# Altium project ina_board_1.PrjPcb
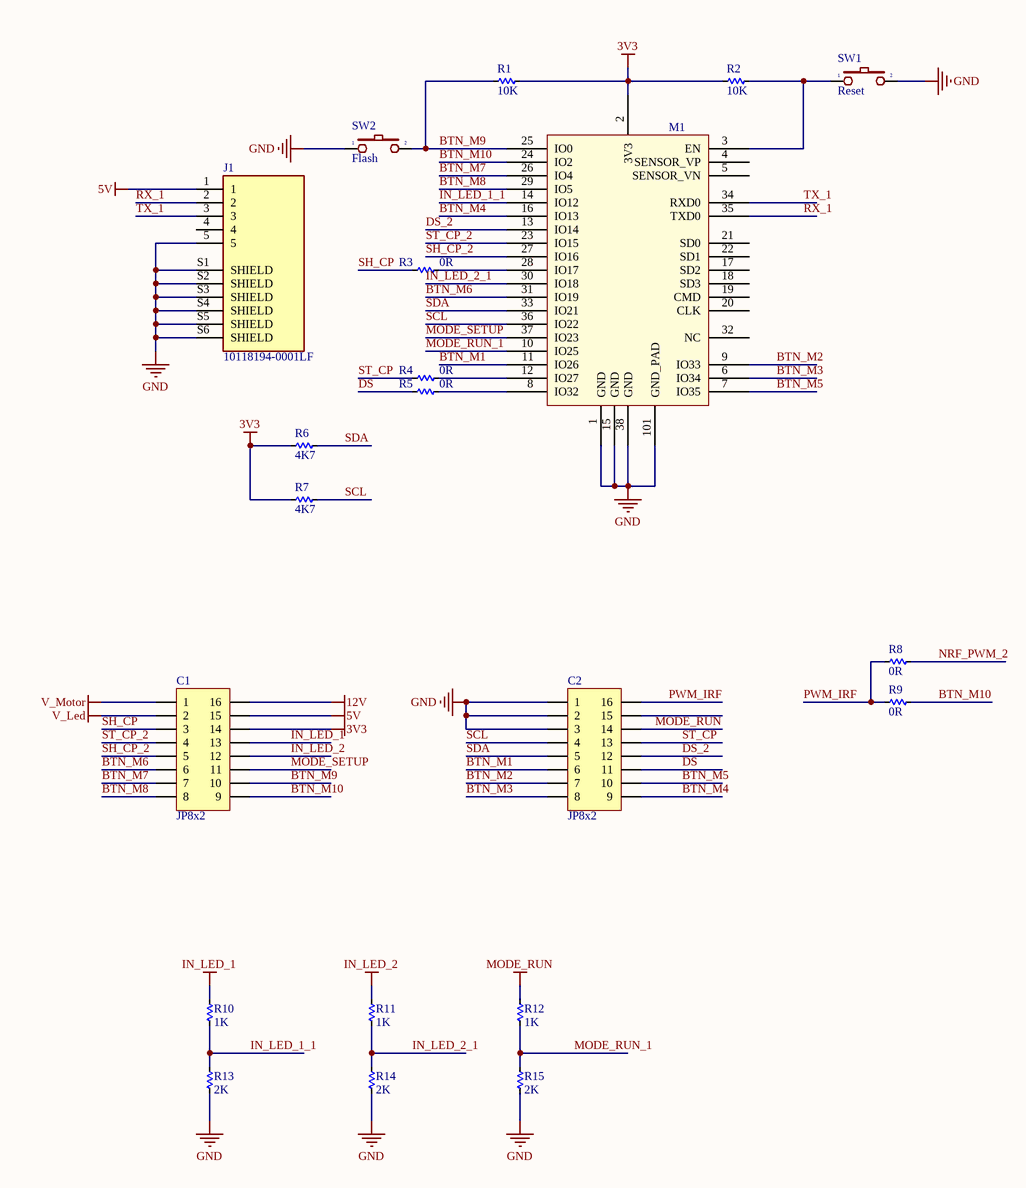
[diagram p0: esp32.SchDoc]
3 sheets, 106 parts. Net scope: global (net labels, ports and power ports of the same name join across sheets).
Board file: board_1.PcbDoc
Sheets:
  esp32.SchDoc
  nrf51.SchDoc
  power.SchDoc

## Sheet esp32.SchDoc
size A3

### Parts
C1  JP8x2  [JP8-C2T]
C2  JP8x2  [JP8-C2T]
J1  10118194-0001LF  [AMPHENOL_10118194-0001LF]
M1  ESP32S_Module  [ESP32S]  (value not drawn)
R1  10K  [RES-SMD-0603]
R2  10K  [RES-SMD-0603]
R3  0R  [RES-SMD-0603]
R4  0R  [RES-SMD-0603]
R5  0R  [RES-SMD-0603]
R6  4K7  [RES-SMD-0603]
R7  4K7  [RES-SMD-0603]
R8  0R  [RES-SMD-0603]
R9  0R  [RES-SMD-0603]
R10  1K  [RES-SMD-0603]
R11  1K  [RES-SMD-0603]
R12  1K  [RES-SMD-0603]
R13  2K  [RES-SMD-0603]
R14  2K  [RES-SMD-0603]
R15  2K  [RES-SMD-0603]
SW1  Reset  [SW1-SMD]
SW2  Flash  [SW-DIP1-1]

### Nets
3V3: C1.14 M1.2(3V3) R1.1 R2.2 R6.1 R7.1
5V: C1.15 J1.1
12V: C1.16
GND: C2.1 C2.2 C2.3 J1.5 J1.S1(SHIELD) J1.S2(SHIELD) J1.S3(SHIELD) J1.S4(SHIELD) J1.S5(SHIELD) J1.S6(SHIELD) M1.1(GND) M1.15(GND) M1.38(GND) M1.101(GND_PAD) R13.1 R14.1 R15.1 SW1.2 SW2.1
IN_LED_1: C1.13 R10.2
IN_LED_2: C1.12 R11.2
MODE_RUN: C2.14 R12.2
V_Led: C1.2
V_Motor: C1.1
BTN_M1: C2.6 M1.11(IO26)
BTN_M2: C2.7 M1.9(IO33)
BTN_M3: C2.8 M1.6(IO34)
BTN_M4: C2.9 M1.16(IO13)
BTN_M5: C2.10 M1.7(IO35)
BTN_M6: C1.6 M1.31(IO19)
BTN_M7: C1.7 M1.26(IO4)
BTN_M8: C1.8 M1.29(IO5)
BTN_M9: C1.10 M1.25(IO0) R1.2 SW2.2
BTN_M10: C1.9 M1.24(IO2) R9.1
DS: C2.11 R5.1
DS_2: C2.12 M1.13(IO14)
IN_LED_1_1: M1.14(IO12) R10.1 R13.2
IN_LED_2_1: M1.30(IO18) R11.1 R14.2
MODE_RUN_1: M1.10(IO25) R12.1 R15.2
MODE_SETUP: C1.11 M1.37(IO23)
NRF_PWM_2: R8.1
PWM_IRF: C2.16 R8.2 R9.2
RX_1: J1.2 M1.35(TXD0)
SCL: C2.4 M1.36(IO22) R7.2
SDA: C2.5 M1.33(IO21) R6.2
SH_CP: C1.3 R3.1
SH_CP_2: C1.5 M1.27(IO16)
ST_CP: C2.13 R4.1
ST_CP_2: C1.4 M1.23(IO15)
TX_1: J1.3 M1.34(RXD0)
NetM1_3: M1.3(EN) R2.1 SW1.1
NetM1_8: M1.8(IO32) R5.2
NetM1_12: M1.12(IO27) R4.2
NetM1_28: M1.28(IO17) R3.2

Not connected (* = marked no-connect by the designer): C2 15; J1 4; M1 4(SENSOR_VP) 5(SENSOR_VN) 17(SD2) 18(SD3) 19(CMD) 20(CLK) 21(SD0) 22(SD1) 32(NC)

### Library data of the parts
C1 C2 = JP8x2: WR-PHD 2.54 mm Dual Socket Header; Manufacturer: W¨¹rth Elektronik eiSos GmbH; partNo: 61301621821; ComponentLink1 Description: Manufacturer; ComponentLink2 Description: Datasheet; NoPins: 16; Created Date: 29 March 2013; ComponentLink1URL: http://www.we-online.com; ComponentLink2URL: http://katalog.we-online.de/em/datasheet/6130xx21821.pdf; Created by: Karrer Zheng
J1 = 10118194-0001LF: USB - micro B USB 2.0 Receptacle Connector 5 Position Surface Mount, Right Angle; Through Hole; MF: Amphenol ICC; Package: None; Price: None; Availability: Unavailable; MP: 10118194-0001LF; SnapEDA_Link: https://www.snapeda.com/parts/10118194-0001LF/Amphenol%20FCI/view-part/1413308/?ref=snap; Value: *
M1 = ESP32S_Module: Esp-32S; Datasheet: https://espressif.com/sites/default/files/documentation/esp_wroom_32_datasheet_en.pdf
R1-R15 = Res-SMD: Resistor; Manufacturer: Generic Components; Class: Passive; Published: 08/06/2000; Publisher: Altium Hobart Technology Centre
SW1 SW2 = SW2: Switch button 2 pin; Value: SW chip 2 pin

## Sheet nrf51.SchDoc
size A
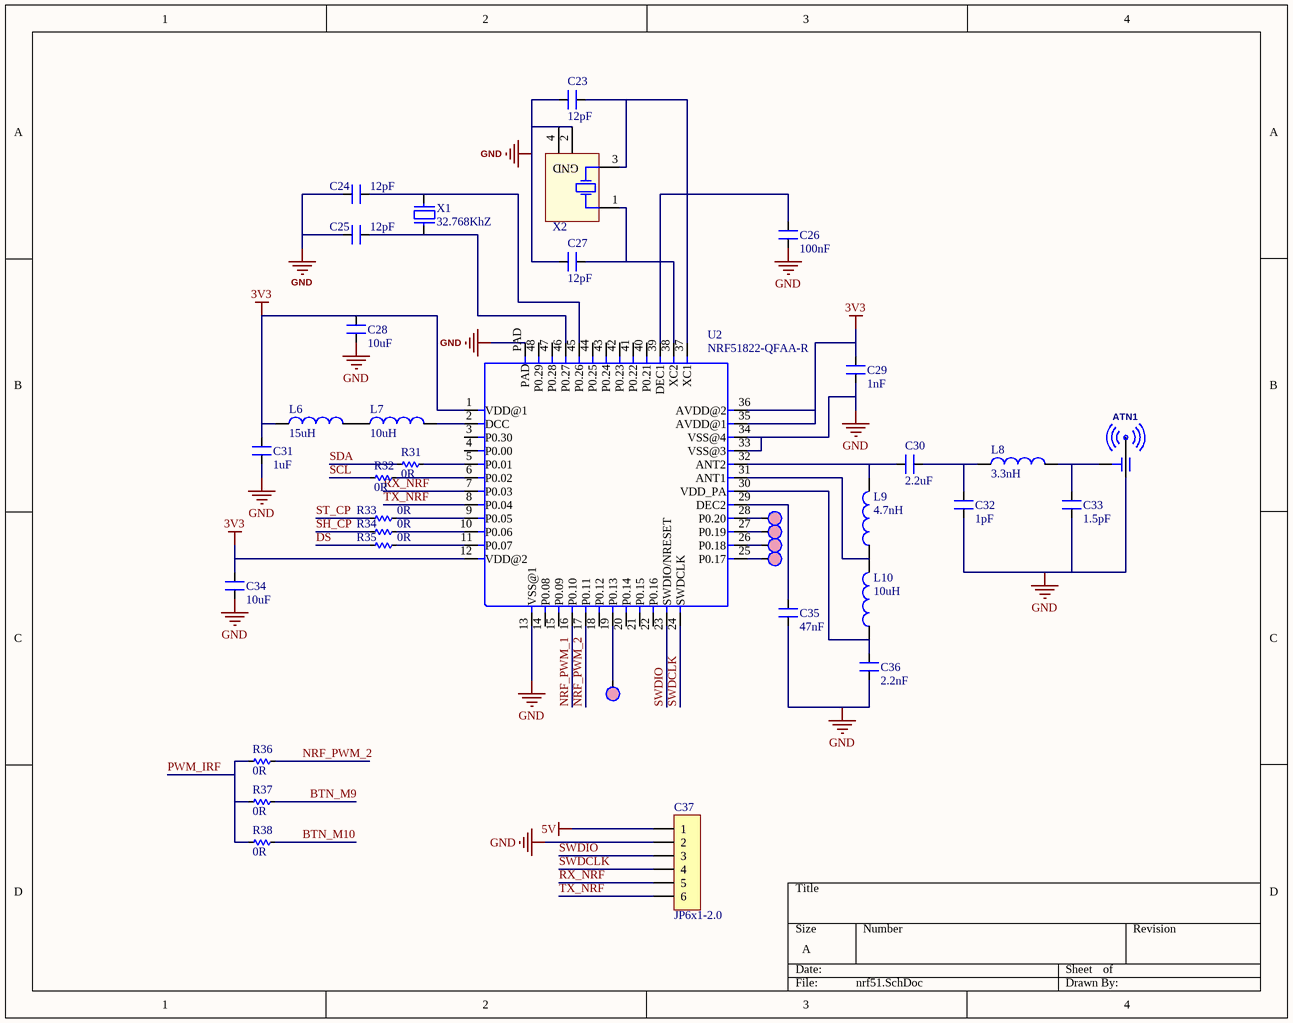
[diagram p1: nrf51.SchDoc]

### Parts
ATN1  P-ANT  [Antenna 2G4]  (value not drawn)
C23  12pF  [CN-SMD-0603]
C24  12pF  [CN-SMD-0603]
C25  12pF  [CN-SMD-0603]
C26  100nF  [CN-SMD-0603]
C27  12pF  [CN-SMD-0603]
C28  10uF  [CN-SMD-0603]
C29  1nF  [CN-SMD-0603]
C30  2.2uF  [CN-SMD-0603]
C31  1uF  [CN-SMD-0603]
C32  1pF  [CN-SMD-0603]
C33  1.5pF  [CN-SMD-0603]
C34  10uF  [CN-SMD-0603]
C35  47nF  [CN-SMD-0603]
C36  2.2nF  [CN-SMD-0603]
C37  JP6x1-2.0  [J6-C1T]
L6  15uH  [INDC1608X95N]
L7  10uH  [INDC1608X95N]
L8  3.3nH  [INDC1608X95N]
L9  4.7nH  [INDC1608X95N]
L10  10uH  [INDC1608X95N]
R31  0R  [RES-SMD-0603]
R32  0R  [RES-SMD-0603]
R33  0R  [RES-SMD-0603]
R34  0R  [RES-SMD-0603]
R35  0R  [RES-SMD-0603]
R36  0R  [RES-SMD-0603]
R37  0R  [RES-SMD-0603]
R38  0R  [RES-SMD-0603]
TP1  TP  [P-TP 1MM]  (value not drawn)  (no BOM)
TP2  TP  [P-TP 1MM]  (value not drawn)  (no BOM)
TP3  TP  [P-TP 1MM]  (value not drawn)  (no BOM)
TP4  TP  [P-TP 1MM]  (value not drawn)  (no BOM)
TP5  TP  [P-TP 1MM]  (value not drawn)  (no BOM)
U2  NRF51822-QFAA-R  [QFN48G-0.4-6X6MM]
X1  32.768KhZ  [XT2-32.768KHz-2_V]
X2  XT4  [XT4-16.000MHz-4_V]  (value not drawn)

### Nets
3V3: C28.1 C29.2 C31.1 C34.1 L6.1 U2.1(VDD@1) U2.12(VDD@2) U2.35(AVDD@1) U2.36(AVDD@2)
5V: C37.1
GND: ATN1.1 C23.1 C24.2 C25.2 C26.2 C27.1 C28.2 C29.1 C31.2 C32.2 C33.2 C34.2 C35.2 C36.2 C37.2 U2.13(VSS@1) U2.33(VSS@3) U2.34(VSS@4) U2.PAD X2.2(GND) X2.4(GND)
BTN_M9: R37.1
BTN_M10: R38.1
DS: R35.1
NRF_PWM_1: U2.16(P0.10)
NRF_PWM_2: R36.1 U2.17(P0.11)
PWM_IRF: R36.2 R37.2 R38.2
RX_NRF: C37.5 U2.7(P0.03)
SCL: R32.2
SDA: R31.2
SH_CP: R34.1
ST_CP: R33.1
SWDCLK: C37.4 U2.24(SWDCLK)
SWDIO: C37.3 U2.23(SWDIO/NRESET)
TX_NRF: C37.6 U2.8(P0.04)
NetATN1_2: ATN1.2 C33.1 L8.2
NetC23_2: C23.2 U2.37(XC1) X2.3(XTAL)
NetC24_1: C24.1 U2.45(P0.26) X1.2
NetC25_1: C25.1 U2.46(P0.27) X1.1
NetC26_1: C26.1 U2.39(DEC1)
NetC27_2: C27.2 U2.38(XC2) X2.1(XTAL)
NetC30_1: C30.1 C32.1 L8.1
NetC30_2: C30.2 L9.2 U2.32(ANT2)
NetC35_1: C35.1 U2.29(DEC2)
NetC36_1: C36.1 L10.1 U2.30(VDD_PA)
NetL6_2: L6.2 L7.1
NetL7_2: L7.2 U2.2(DCC)
NetL9_1: L9.1 L10.2 U2.31(ANT1)
NetR31_1: R31.1 U2.5(P0.01)
NetR32_1: R32.1 U2.6(P0.02)
NetR33_2: R33.2 U2.9(P0.05)
NetR34_2: R34.2 U2.10(P0.06)
NetR35_2: R35.2 U2.11(P0.07)
NetTP1_1: TP1.1 U2.28(P0.20)
NetTP2_1: TP2.1 U2.27(P0.19)
NetTP3_1: TP3.1 U2.26(P0.18)
NetTP4_1: TP4.1 U2.25(P0.17)
NetTP5_1: TP5.1 U2.19(P0.13)

Not connected (* = marked no-connect by the designer): U2 3(P0.30) 4(P0.00) 14(P0.08) 15(P0.09) 18(P0.12) 20(P0.14) 21(P0.15) 22(P0.16) 40(P0.21) 41(P0.22) 42(P0.23) 43(P0.24) 44(P0.25) 47(P0.28) 48(P0.29)

### Library data of the parts
C23-C36 = CN: Tu gom; Value: 33pF
C37 = JP6x1-2.0: WR-PHD 2.00 mm Socket Header; Manufacturer: W¨¹rth Elektronik eiSos GmbH; partNo: 62000611821; ComponentLink1 Description: Manufacturer; ComponentLink2 Description: Datasheet; NoPins: 06; Created Date: 2 April 2013; ComponentLink1URL: http://www.we-online.com; ComponentLink2URL: http://katalog.we-online.de/em/datasheet/6200xx11821.pdf; Created by: Karrer Zheng
L6-L10 = ASMCI-0603-100N-T: Ind Chip Shielded Multi-Layer 10uH 30% 1MHz Ferrite 50mA 0603 T/R; Package: None; Price: None; Value: *; MP: ASMCI-0603-100N-T; Availability: Unavailable
R31-R38 = Res-SMD: as R1 on sheet esp32; Published: 08/06/2000; Publisher: Altium Hobart Technology Centre
TP1-TP5 = P-TESTPOINT
U2 = NRF51822-QFAA-R: IC RF TxRx + MCU Bluetooth, General ISM > 1GHz Bluetooth v4.0 2.4GHz 48-VFQFN Exposed Pad; MF: Nordic; SnapEDA_Link: https://www.snapeda.com/parts/NRF51822-QFAA-R/Nordic%20Semiconductor%20ASA/view-part/49437/?ref=snap; Availability: Warning; MP: NRF51822-QFAA-R; Value: *; Price: None; Package: VFQFN-48 Nordic; BuyPart: https://www.snapeda.com/parts/NRF51822-QFAA-R/Nordic%20Semiconductor%20ASA/view-part/49437/?ref=eda
X1 = XT2: Crystal, 32.768 KHz, -40 to 85 degC, 3.2 x 1.5 x 0.9 mm SMD; Value: 4Mhz
X2 = XT4: Crystal, 16 MHz, -30 to 85 degC, 3.2 x 2.5 x 0.9 mm SMD; Value: 4Mhz

## Sheet power.SchDoc
size A3
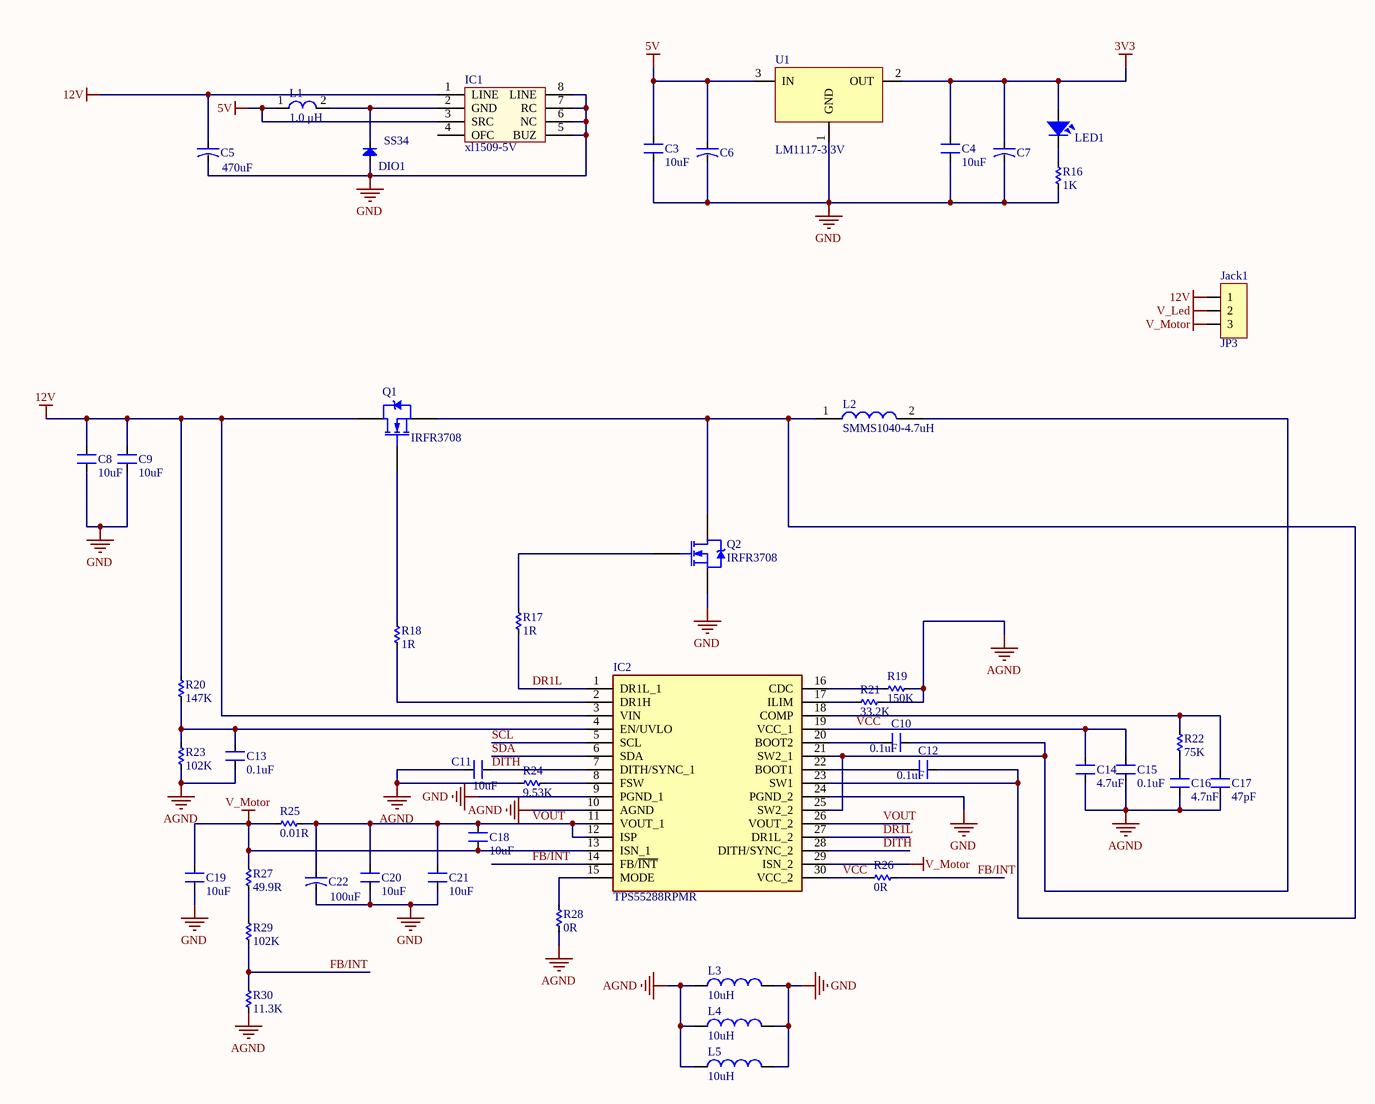
[diagram p2: power.SchDoc]

### Parts
C3  10uF  [CN-SMD-0603]
C4  10uF  [CN-SMD-0603]
C5  470uF  [CAP-ALU-SMD-6.3x7.7x2.2]
C6  CN-ALU-SMD  [CAP-ALU-SMD-4.5x5x1.4]  (value not drawn)
C7  CN-ALU-SMD  [CAP-ALU-SMD-4.5x5x1.4]  (value not drawn)
C8  10uF  [CN-SMD-1206]
C9  10uF  [CN-SMD-1206]
C10  0.1uF  [CN-SMD-0603]
C11  10uF  [CN-SMD-0603]
C12  0.1uF  [CN-SMD-0603]
C13  0.1uF  [CN-SMD-0603]
C14  4.7uF  [CN-SMD-0603]
C15  0.1uF  [CN-SMD-0603]
C16  4.7nF  [CN-SMD-0603]
C17  47pF  [CN-SMD-0603]
C18  10uF  [CN-SMD-0603]
C19  10uF  [CN-SMD-0603]
C20  10uF  [CN-SMD-0603]
C21  10uF  [CN-SMD-0603]
C22  100uF  [CAP-ALU-SMD-6.3x7.7x2.2]
DIO1  SS34  [DIO-SMD-106]
IC1  xl1509-5V  [SO-8]
IC2  TPS55288RPMR  [TPS55288RPMR]
Jack1  JP3  [JP3-D1T]
L1  1.0 μH  [L-SMD-M-7.3x4.5]
L2  SMMS1040-4.7uH  [INDPM115100X400N]
L3  10uH  [INDC1608X95N]
L4  10uH  [INDC1608X95N]
L5  10uH  [INDC1608X95N]
LED1  LED  [LED-0805-Blue]  (value not drawn)
Q1  IRFR3708  [TO-252AA_N]
Q2  IRFR3708  [TO-252AA_N]
R16  1K  [RES-SMD-0603]
R17  1R  [RES-SMD-0603]
R18  1R  [RES-SMD-0603]
R19  150K  [RES-SMD-0603]
R20  147K  [RES-SMD-0603]
R21  33.2K  [RES-SMD-0603]
R22  75K  [RES-SMD-0603]
R23  102K  [RES-SMD-0603]
R24  9.53K  [RES-SMD-0603]
R25  0.01R  [RES-SMD-1206]
R26  0R  [RES-SMD-0603]
R27  49.9R  [RES-SMD-0603]
R28  0R  [RES-SMD-0603]
R29  102K  [RES-SMD-0603]
R30  11.3K  [RES-SMD-0603]
U1  LM1117-3.3V  [SOT223]

### Nets
3V3: C4.1 C7.1 LED1.1 U1.2(OUT)
5V: C3.1 C6.1 IC1.3(SRC) L1.1 U1.3(IN)
12V: C5.1 C8.2 C9.2 IC1.1(LINE) IC2.3(VIN) Jack1.1 Q1.4(D) R20.1
AGND: C11.2 C13.1 C14.1 C15.1 C16.2 C17.2 IC2.10(AGND) L3.1 L4.1 L5.1 R19.2 R21.2 R23.2 R24.1 R28.2 R30.2
GND: C3.2 C4.2 C5.2 C6.2 C7.2 C8.1 C9.1 C19.1 C20.1 C21.1 C22.2 DIO1.1(A) IC1.5(BUZ) IC1.6(NC) IC1.7(RC) IC1.8(LINE) IC2.9(PGND_1) IC2.24(PGND_2) L3.2 L4.2 L5.2 Q2.3(S) R16.2 U1.1(GND)
V_Led: Jack1.2
V_Motor: C18.1 C19.2 IC2.13(ISN_1) IC2.29(ISN_2) Jack1.3 R25.2 R27.1
DITH: C11.1 IC2.7(DITH/SYNC_1) IC2.28(DITH/SYNC_2)
DR1L: IC2.1(DR1L_1) IC2.27(DR1L_2) R17.2
FB/INT: IC2.14(FB/~{INT}) R26.2 R29.2 R30.1
SCL: IC2.5(SCL)
SDA: IC2.6(SDA)
VCC: C14.2 C15.2 IC2.19(VCC_1) IC2.30(VCC_2) R26.1
VOUT: C18.2 C20.2 C21.2 C22.1 IC2.11(VOUT_1) IC2.12(ISP) IC2.26(VOUT_2) R25.1
NetC10_1: C10.1 IC2.21(SW2_1) IC2.25(SW2_2) L2.2
NetC10_2: C10.2 IC2.20(BOOT2)
NetC12_1: C12.1 IC2.23(SW1) L2.1 Q1.3(S) Q2.4(D)
NetC12_2: C12.2 IC2.22(BOOT1)
NetC13_2: C13.2 IC2.4(EN/UVLO) R20.2 R23.1
NetC16_1: C16.1 R22.2
NetC17_1: C17.1 IC2.18(COMP) R22.1
NetDIO1_2: DIO1.2(K) IC1.2(GND) L1.2
NetIC2_2: IC2.2(DR1H) R18.2
NetIC2_8: IC2.8(FSW) R24.2
NetIC2_15: IC2.15(MODE) R28.1
NetIC2_16: IC2.16(CDC) R19.1
NetIC2_17: IC2.17(ILIM) R21.1
NetLED1_2: LED1.2 R16.1
NetQ1_1: Q1.1(G) R18.1
NetQ2_1: Q2.1(G) R17.1
NetR27_2: R27.2 R29.1

Not connected (* = marked no-connect by the designer): IC1 4(OFC)

### Library data of the parts
C3 C4 C8-C12 C14-C21 = CN: Tu gom; Value: 33pF
C5-C7 C22 = CN-ALU-SMD: Polarized Capacitor (Axial); Published: 8-Jun-2000; LatestRevisionDate: 17-Jul-2002; LatestRevisionNote: Re-released for DXP Platform.; PackageReference: POLAR0.8; Publisher: Altium Limited
C13 = CN: Value: 33pF
DIO1 = Diode SMD: Default Diode; Code - JEDEC: DO-214-AB; Value: 1N5007; Published: 8-Jun-2000; Revision: July-2002: Re-released for DXP Platform.; Publisher: Altium Limited
IC1 = LS1240A: Electronic Two-Tone Ringer
IC2 = TPS55288RPMR: Integrated Circuit; Manufacturer_Name: Texas Instruments; Datasheet Link: https://www.ti.com/lit/ds/symlink/tps55288.pdf; Height: 1mm; Manufacturer_Part_Number: TPS55288RPMR; Mouser Part Number: 595-TPS55288RPMR; Mouser Price/Stock: https://www.mouser.co.uk/ProductDetail/Texas-Instruments/TPS55288RPMR?qs=bAKSY%2FctAC57bSsN8PUBnQ%3D%3D; Arrow Part Number: TPS55288RPMR; Arrow Price/Stock: https://www.arrow.com/en/products/tps55288rpmr/texas-instruments?region=nac
Jack1 = JP3: WR-PHD 2.54 mm Angled Socket Header; Manufacturer: W¨¹rth Elektronik eiSos GmbH; partNo: 613003143121; ComponentLink1 Description: Manufacturer; ComponentLink2 Description: Datasheet; NoPins: 03; Created Date: 29 March 2013; ComponentLink1URL: http://www.we-online.com; ComponentLink2URL: http://katalog.we-online.de/em/datasheet/6130xx143121.pdf; Created by: Karrer Zheng
L1 = L-SMD-1: partNo: 78477010; Manufacturer: Wurth Elektronik; Inductance: 1.0 μH; ComponentLink1Description: Manufacturer; ComponentLink1URL: http://www.we-online.de; Created by: Baojun Chen; Created Date: Nov.2015; ComponentLink2Description: Datasheet; ComponentLink2URL: http://katalog.we-online.de/pbs/datasheet/78477010.pdf
L2 = SMMS1040-220M: Inductor; Manufacturer_Name: Shun Xiang Nuo Elec; Datasheet Link: https://datasheet.lcsc.com/szlcsc/ShunXiang-Connaught-Elec-SMMS1040-220M_C149597.pdf; Height: 4mm; Manufacturer_Part_Number: SMMS1040-220M
L3-L5 = ASMCI-0603-100N-T: as L6 on sheet nrf51; Package: None; Price: None; Value: *; MP: ASMCI-0603-100N-T; Availability: Unavailable
LED1 = LED SMD: Value: LED 3 - 5 ly 2 Colour
Q1 Q2 = IRFR3910: HEXFET Power MOSFET; Note: Pin 2 is trimmed and is electrically connected to Drain.; Published: 8-Jun-2000; LatestRevisionDate: 20-Nov-2009; LatestRevisionNote: IPC-7351 Footprint Added.; DatasheetVersion: May-1998; PackageVersion: Feb-2003; PackageReference: TO-252AA; Publisher: Altium Limited; PackageDescription: 3-Pin HEXFET Package 2.28 mm Pitch, 9.9 mm Lead Span; Code_JEDEC: TO-252-AA; ComponentLink1Description: Manufacturer Link; ComponentLink1URL: http://www.irf.com/; ComponentLink2Description: Datasheet; ComponentLink2URL: http://www.irf.com/product-info/datasheets/data/irfr3910.pdf
R16-R30 = Res-SMD: as R1 on sheet esp32; Published: 08/06/2000; Publisher: Altium Hobart Technology Centre
U1 = LM1117: 800mA Low-Dropout Linear Regulator; Creator: Nguyen Ba Bien; Website: http://group3i.net

## Nets that join several sheets
3V3: esp32 (6 pins), nrf51 (9 pins), power (C4.1 C7.1 LED1.1 U1.2)
5V: esp32 (C1.15 J1.1), nrf51 (C37.1), power (5 pins)
12V: esp32 (C1.16), power (8 pins)
GND: esp32 (19 pins), nrf51 (21 pins), power (24 pins)
V_Led: esp32 (C1.2), power (Jack1.2)
V_Motor: esp32 (C1.1), power (7 pins)
BTN_M9: esp32 (C1.10 M1.25 R1.2 SW2.2), nrf51 (R37.1)
BTN_M10: esp32 (C1.9 M1.24 R9.1), nrf51 (R38.1)
DS: esp32 (C2.11 R5.1), nrf51 (R35.1)
NRF_PWM_2: esp32 (R8.1), nrf51 (R36.1 U2.17)
PWM_IRF: esp32 (C2.16 R8.2 R9.2), nrf51 (R36.2 R37.2 R38.2)
SCL: esp32 (C2.4 M1.36 R7.2), nrf51 (R32.2), power (IC2.5)
SDA: esp32 (C2.5 M1.33 R6.2), nrf51 (R31.2), power (IC2.6)
SH_CP: esp32 (C1.3 R3.1), nrf51 (R34.1)
ST_CP: esp32 (C2.13 R4.1), nrf51 (R33.1)